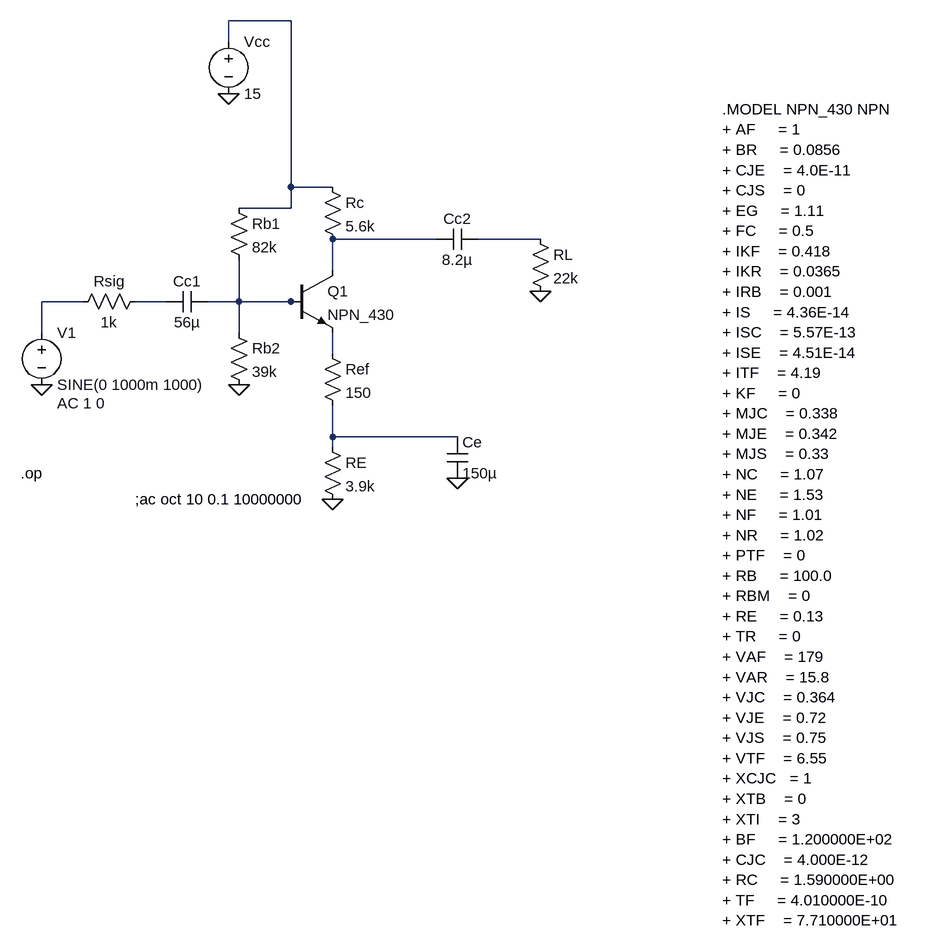
[diagram p0: schematic Final.asc]
Final.asc, the LTspice schematic file:
Version 4
SHEET 1 6264 1356
WIRE 128 64 32 64
WIRE 32 96 32 64
WIRE 128 320 128 64
WIRE 192 320 128 320
WIRE 128 352 128 320
WIRE 128 352 48 352
WIRE 352 400 192 400
WIRE 512 400 416 400
WIRE 192 448 192 400
WIRE -192 496 -256 496
WIRE -64 496 -112 496
WIRE 48 496 48 432
WIRE 48 496 0 496
WIRE 128 496 48 496
WIRE 144 496 128 496
WIRE -256 544 -256 496
WIRE 48 544 48 496
WIRE 192 576 192 544
WIRE 192 704 192 656
WIRE 384 704 192 704
WIRE 192 720 192 704
FLAG 32 176 0
FLAG 48 624 0
FLAG 192 800 0
FLAG 384 768 0
FLAG -256 624 0
FLAG 512 480 0
SYMBOL voltage 32 80 R0
SYMATTR InstName Vcc
SYMATTR Value 15
SYMBOL res 32 336 R0
SYMATTR InstName Rb1
SYMATTR Value 82k
SYMBOL res 176 304 R0
SYMATTR InstName Rc
SYMATTR Value 5.6k
SYMBOL res 32 528 R0
SYMATTR InstName Rb2
SYMATTR Value 39k
SYMBOL res 176 560 R0
SYMATTR InstName Ref
SYMATTR Value 150
SYMBOL res 176 704 R0
SYMATTR InstName RE
SYMATTR Value 3.9k
SYMBOL npn 128 448 R0
SYMATTR InstName Q1
SYMATTR Value NPN_430
SYMBOL cap -64 512 R270
WINDOW 0 32 32 VTop 2
WINDOW 3 0 32 VBottom 2
SYMATTR InstName Cc1
SYMATTR Value 56µ
SYMBOL cap 352 416 R270
WINDOW 0 32 32 VTop 2
WINDOW 3 0 32 VBottom 2
SYMATTR InstName Cc2
SYMATTR Value 8.2µ
SYMBOL cap 368 704 R0
SYMATTR InstName Ce
SYMATTR Value 150µ
SYMBOL res -96 480 R90
WINDOW 0 0 56 VBottom 2
WINDOW 3 32 56 VTop 2
SYMATTR InstName Rsig
SYMATTR Value 1k
SYMBOL voltage -256 528 R0
WINDOW 123 24 124 Left 2
WINDOW 39 0 0 Left 0
SYMATTR Value2 AC 1 0
SYMATTR InstName V1
SYMATTR Value SINE(0 1000m 1000)
SYMBOL res 496 384 R0
SYMATTR InstName RL
SYMATTR Value 22k
TEXT 792 200 Left 2 !.MODEL NPN_430 NPN\n+ AF     = 1             \n+ BR     = 0.0856        \n+ CJE    = 4.0E-11      \n+ CJS    = 0             \n+ EG     = 1.11          \n+ FC     = 0.5           \n+ IKF    = 0.418         \n+ IKR    = 0.0365        \n+ IRB    = 0.001         \n+ IS     = 4.36E-14      \n+ ISC    = 5.57E-13      \n+ ISE    = 4.51E-14      \n+ ITF    = 4.19          \n+ KF     = 0             \n+ MJC    = 0.338         \n+ MJE    = 0.342         \n+ MJS    = 0.33          \n+ NC     = 1.07          \n+ NE     = 1.53          \n+ NF     = 1.01          \n+ NR     = 1.02          \n+ PTF    = 0             \n+ RB     = 100.0          \n+ RBM    = 0             \n+ RE     = 0.13          \n+ TR     = 0             \n+ VAF    = 179           \n+ VAR    = 15.8          \n+ VJC    = 0.364         \n+ VJE    = 0.72          \n+ VJS    = 0.75          \n+ VTF    = 6.55          \n+ XCJC   = 1             \n+ XTB    = 0             \n+ XTI    = 3             \n+ BF     = 1.200000E+02\n+ CJC    = 4.000E-12\n+ RC     = 1.590000E+00  \n+ TF     = 4.010000E-10\n+ XTF    = 7.710000E+01
TEXT -288 760 Left 2 !.op
TEXT -112 800 Left 2 !;ac oct 10 0.1 10000000

The netlist it stands for:
* Final.asc
Vcc N001 0 15
Rb1 N001 N006 82k
Rc N001 N002 5.6k
Rb2 N006 0 39k
Ref N007 N008 150
RE N008 0 3.9k
Q1 N002 N006 N007 0 NPN_430
Cc1 N005 N006 56µ
Cc2 N002 N003 8.2µ
Ce N008 0 150µ
Rsig N005 N004 1k
V1 N004 0 SINE(0 1000m 1000) AC 1 0
RL N003 0 22k
.model NPN NPN
.model PNP PNP
.lib standard.bjt
.MODEL NPN_430 NPN
+ AF     = 1
+ BR     = 0.0856
+ CJE    = 4.0E-11
+ CJS    = 0
+ EG     = 1.11
+ FC     = 0.5
+ IKF    = 0.418
+ IKR    = 0.0365
+ IRB    = 0.001
+ IS     = 4.36E-14
+ ISC    = 5.57E-13
+ ISE    = 4.51E-14
+ ITF    = 4.19
+ KF     = 0
+ MJC    = 0.338
+ MJE    = 0.342
+ MJS    = 0.33
+ NC     = 1.07
+ NE     = 1.53
+ NF     = 1.01
+ NR     = 1.02
+ PTF    = 0
+ RB     = 100.0
+ RBM    = 0
+ RE     = 0.13
+ TR     = 0
+ VAF    = 179
+ VAR    = 15.8
+ VJC    = 0.364
+ VJE    = 0.72
+ VJS    = 0.75
+ VTF    = 6.55
+ XCJC   = 1
+ XTB    = 0
+ XTI    = 3
+ BF     = 1.200000E+02
+ CJC    = 4.000E-12
+ RC     = 1.590000E+00
+ TF     = 4.010000E-10
+ XTF    = 7.710000E+01
.op
;ac oct 10 0.1 10000000
.backanno
.end